# Altium schematic sheet chess_timer.SchDoc
size B
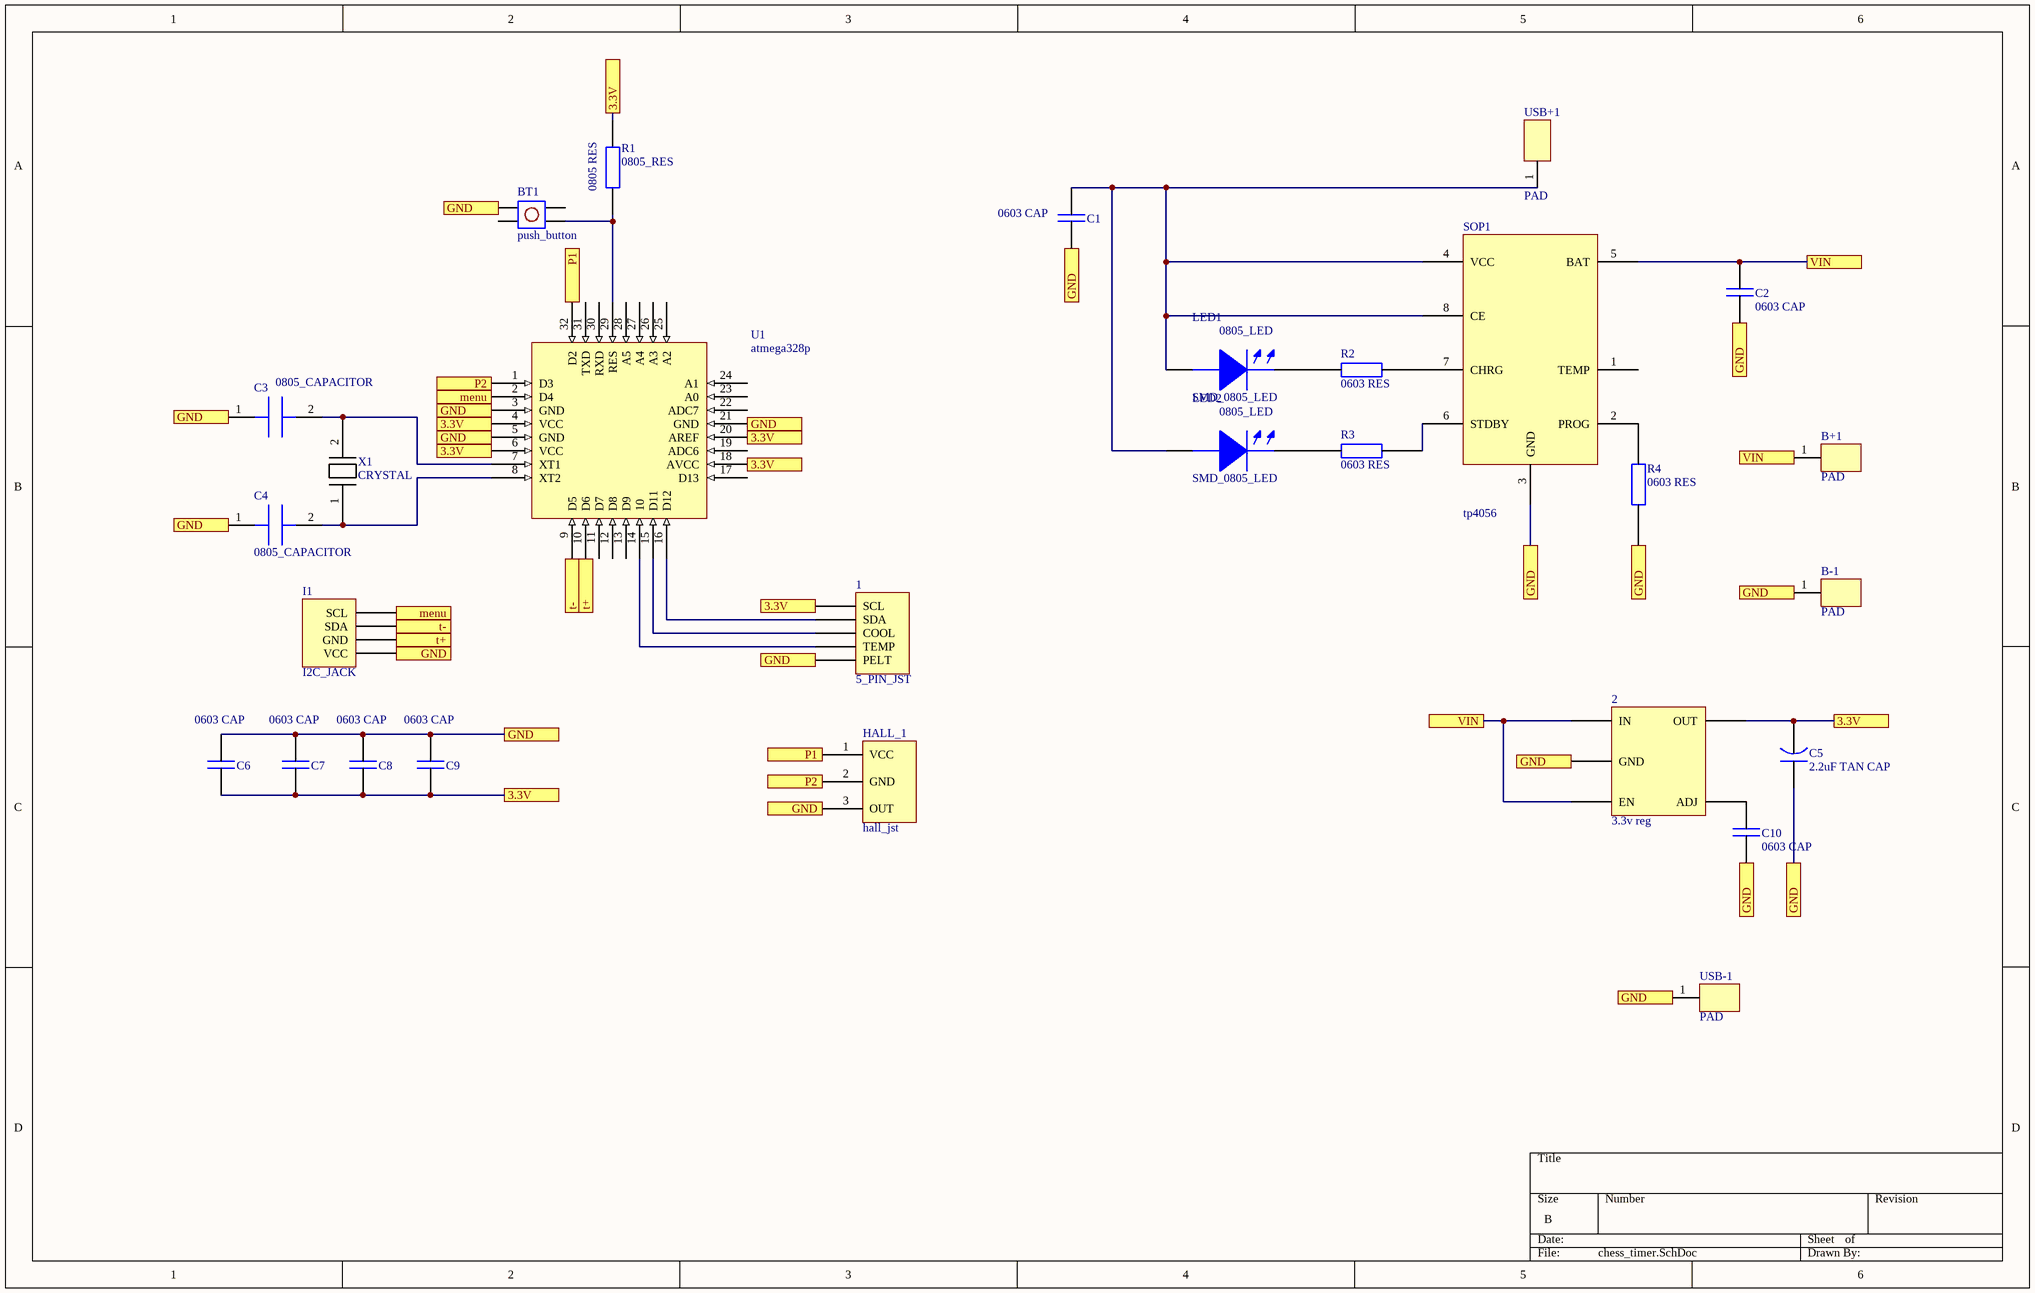
[diagram p0: chess_timer.SchDoc]

## Parts
1  5_PIN_JST  [5_PIN_JST]
2  3.3v reg  [3.3v reg]
B+1  PAD  [PAD]
B-1  PAD  [PAD]
BT1  push_button  [DIP_button]
C1  0603 CAP  [0603 CAP]
C2  0603 CAP  [0603 CAP]
C3  0805_CAPACITOR  [0805_CAP]
C4  0805_CAPACITOR  [0805_CAP]
C5  2.2uF TAN CAP  [2.2uF TAN CAP]
C6  0603 CAP  [0603 CAP]
C7  0603 CAP  [0603 CAP]
C8  0603 CAP  [0603 CAP]
C9  0603 CAP  [0603 CAP]
C10  0603 CAP  [0603 CAP]
HALL_1  hall_jst  [hall_jst]
I1  I2C_JACK  [4PIN_JST]
LED1  SMD_0805_LED  [0805_LED]
LED2  SMD_0805_LED  [0805_LED]
R1  0805_RES  [0805_RES]
R2  0603 RES  [0603 RES]
R3  0603 RES  [0603 RES]
R4  0603 RES  [0603 RES]
SOP1  tp4056  [tp4056]
U1  atmega328p  [atmega328p]
USB+1  PAD  [PAD]
USB-1  PAD  [PAD]
X1  CRYSTAL  [CRYSTAL]

## Ports
3.3V, GND, menu, P1, P2, t+, t-, VIN

## Nets
3.3V: 1.1(SCL) 2.5(OUT) C5.2 C6.1 C7.1 C8.1 C9.1 R1.2 U1.4(VCC) U1.6(VCC) U1.18(AVCC) U1.20(AREF) ; port 3.3V
GND: 1.5(PELT) 2.2(GND) B-1.1 BT1.1 C1.1 C2.1 C3.1 C4.1 C5.1 C6.2 C7.2 C8.2 C9.2 C10.1 HALL_1.3(OUT) I1.1(VCC) R4.1 SOP1.3(GND) U1.3(GND) U1.5(GND) U1.21(GND) USB-1.1 ; port GND
menu: I1.4(SCL) U1.2(D4) ; port menu
P1: HALL_1.1(VCC) U1.32(D2) ; port P1
P2: HALL_1.2(GND) U1.1(D3) ; port P2
t+: I1.2(GND) U1.10(D6) ; port t+
t-: I1.3(SDA) U1.9(D5) ; port t-
VIN: 2.1(IN) 2.3(EN) B+1.1 C2.2 SOP1.5(BAT) ; port VIN
Net1_2: 1.2(SDA) U1.16(D12)
Net1_3: 1.3(COOL) U1.15(D11)
Net1_4: 1.4(TEMP) U1.14(10)
Net2_4: 2.4(ADJ) C10.2
NetBT1_4: BT1.4 R1.1 U1.29(RES)
NetC1_2: C1.2 LED1.1 LED2.1 SOP1.4(VCC) SOP1.8(CE) USB+1.1
NetC3_2: C3.2 U1.7(XT1) X1.2
NetC4_2: C4.2 U1.8(XT2) X1.1
NetLED1_2: LED1.2 R2.1
NetLED2_2: LED2.2 R3.1
NetR2_2: R2.2 SOP1.7(CHRG)
NetR3_2: R3.2 SOP1.6(STDBY)
NetR4_2: R4.2 SOP1.2(PROG)

Not connected (* = marked no-connect by the designer): BT1 2 3; SOP1 1(TEMP); U1 11(D7) 12(D8) 13(D9) 17(D13) 19(ADC6) 22(ADC7) 23(A0) 24(A1) 25(A2) 26(A3) 27(A4) 28(A5) 30(RXD) 31(TXD)

## Notes on the sheet
- (in symbol 0805_RES) 0805 RES
- (in symbol SMD_0805_LED) 0805_LED

## Library data of the parts
BT1 = push_button: DIP tacttil push button